# Altium schematic sheet Power.SchDoc
size A4
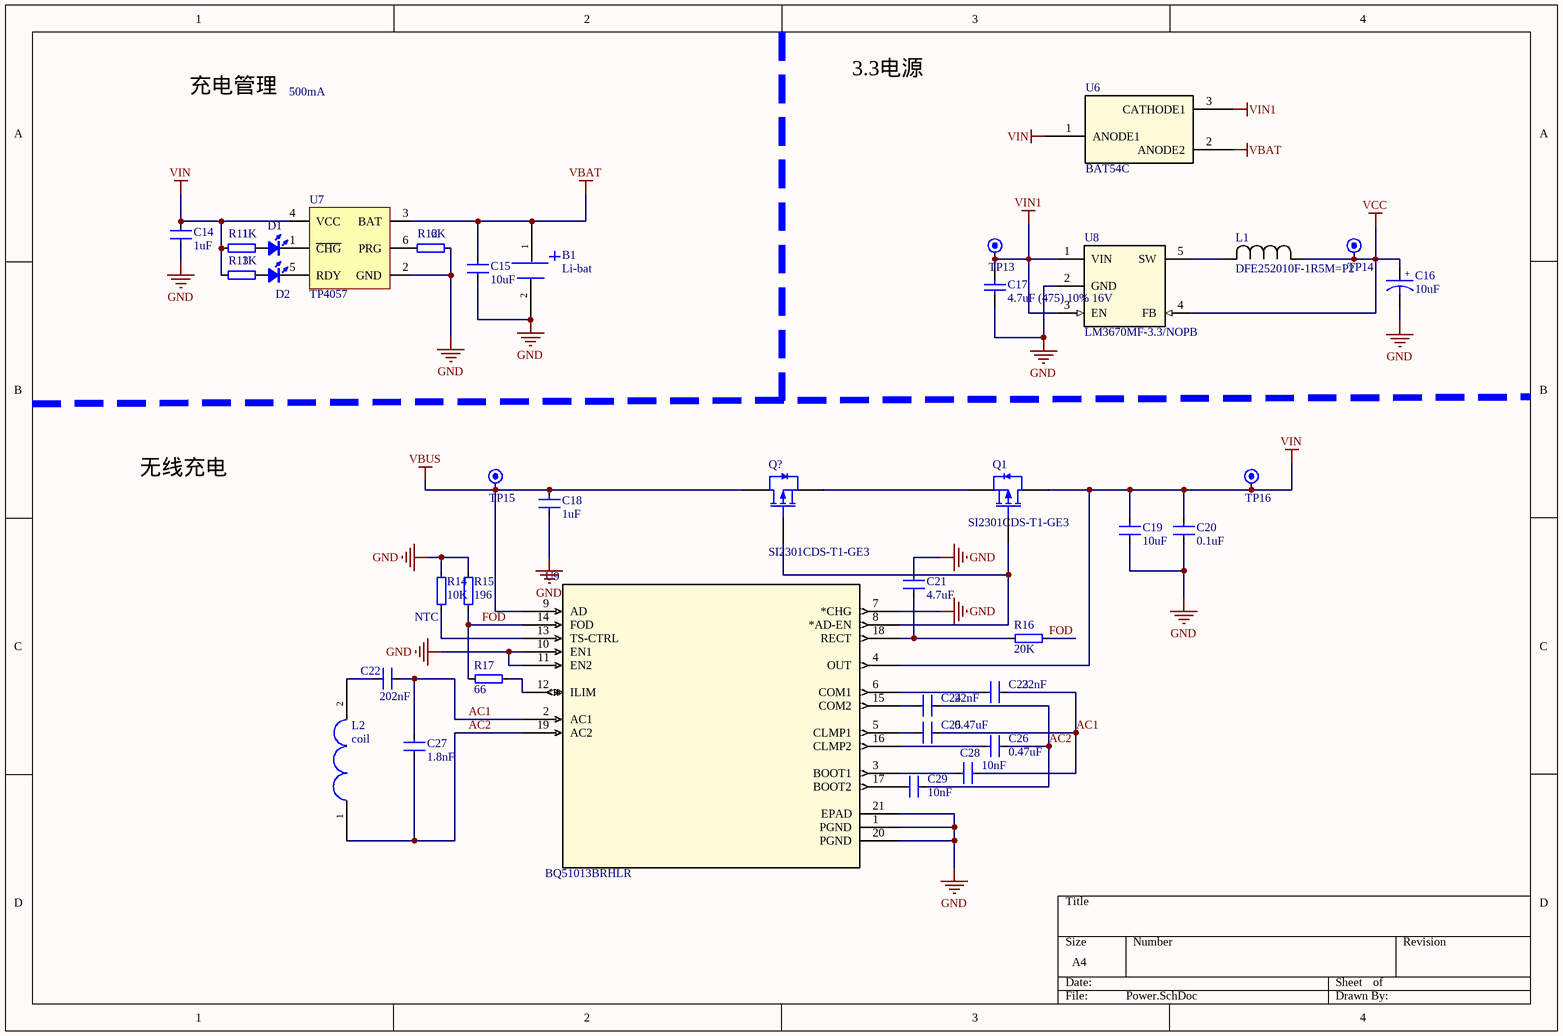
[diagram p0: Power.SchDoc]

## Parts
B1  Li-bat  [bat_li]
C14  1uF  [C0402]
C15  10uF  [C0402]
C16  10uF  [C-A]
C17  4.7uF (475) 10% 16V  [0603_C]
C18  1uF  [C0402]
C19  10uF  [C0402]
C20  0.1uF  [C0402]
C21  4.7uF  [C1206]
C22  202nF  [C0402]
C23  22nF  [C0402]
C24  22nF  [C0402]
C25  0.47uF  [C0402]
C26  0.47uF  [C0402]
C27  1.8nF  [C0402]
C28  10nF  [C0402]
C29  10nF  [C0402]
D1  color?  [LED_0402_RED]  (value not drawn)
D2  color?  [LED_0402_RED]  (value not drawn)
L1  DFE252010F-1R5M=P2  [IND_DFE252010F-1R5M=P2_MUR-M]
L2  coil  [bat_li]
Q1  SI2301CDS-T1-GE3  [SOT-23(SOT-23-3)]
Q?  SI2301CDS-T1-GE3  [SOT-23(SOT-23-3)]
R11  1K  [R0402]
R12  6K  [R0402]
R13  1K  [R0402]
R14  10K  PAKING: NTC  [R0402]
R15  196  [R0402]
R16  20K  [R0402]
R17  66  [R0402]
TP13  TP  [Test-Point]  (value not drawn)
TP14  TP  [Test-Point]  (value not drawn)
TP15  TP  [Test-Point]  (value not drawn)
TP16  TP  [Test-Point]  (value not drawn)
U6  BAT54C  [SOT23_NEX-L]
U7  TP4057  [SOT23-6]
U8  LM3670MF-3.3/NOPB  [SOT23-5]
U9  BQ51013BRHLR  [RHL20_2P05X3P05]

## Nets
GND: B1.2 C14.2 C15.2 C16.2 C17.1 C18.2 C19.2 C20.2 C21.1 R12.2 R14.2 R15.1 U7.2(GND) U8.2(GND) U9.1(PGND) U9.7(*CHG) U9.10(EN1) U9.11(EN2) U9.20(PGND) U9.21(EPAD)
VBAT: B1.1 C15.1 U6.2(ANODE2) U7.3(BAT)
VBUS: C18.1 Q?.3(D) TP15.1(Test_Point) U9.9(AD)
VCC: C16.1 L1.1 TP14.1(Test_Point) U8.4(FB)
VIN: C14.1 C19.1 C20.1 Q1.3(D) R11.1 R13.1 TP16.1(Test_Point) U6.1(ANODE1) U7.4(VCC) U9.4(OUT)
VIN1: C17.2 TP13.1(Test_Point) U6.3(CATHODE1) U8.1(VIN) U8.3(EN)
AC1: C22.2 C23.2 C25.2 C27.2 C28.2 U9.2(AC1)
AC2: C24.2 C26.2 C27.1 C29.1 L2.1 U9.19(AC2)
FOD: R15.2 R16.1 R17.2 U9.14(FOD)
NetC21_2: C21.2 R16.2 U9.18(RECT)
NetC22_1: C22.1 L2.2
NetC23_1: C23.1 U9.6(COM1)
NetC24_1: C24.1 U9.15(COM2)
NetC25_1: C25.1 U9.5(CLMP1)
NetC26_1: C26.1 U9.16(CLMP2)
NetC28_1: C28.1 U9.3(BOOT1)
NetC29_2: C29.2 U9.17(BOOT2)
NetD1_1: D1.1(A) R11.2
NetD1_2: D1.2(K) U7.1(~{CHG})
NetD2_1: D2.1(A) R13.2
NetD2_2: D2.2(K) U7.5(RDY)
NetL1_2: L1.2 U8.5(SW)
NetQ1_1: Q1.1(G) Q?.1(G) U9.8(*AD-EN)
NetQ1_2: Q1.2(S) Q?.2(S)
NetR12_1: R12.1 U7.6(PRG)
NetR14_1: R14.1 U9.13(TS-CTRL)
NetR17_1: R17.1 U9.12(ILIM)

## Notes on the sheet
- 充电管理
- 500mA
- 3.3电源
- 无线充电
- (in symbol CAP-T) +

## Library data of the parts
C14 C15 C18-C29 = CAP
C16 = CAP-T: 钽电容
C17 = 0603 4.7uF (475) 10% 16V: 贴片电容; ComponentLink1Description: 供应商链接; ComponentLink1URL: http://www.szlcsc.com/product/details_20375.html; Package: 0603; Supplier: LC; SuppliersPartNumber: C19666
D1 D2 = LED_0402: LED; Type: 0402; Value: color?
L1 = DFE252010F-1R5M=P2: No Description Available; Mfr_Name: Murata; Type: DEV; Copyright: Copyright (C) 2022 Ultra Librarian. All rights reserved.; Manufacturer_Part_Number: DFE252010F-1R5M=P2; RefDes: RefDes
L2 = L
Q1 Q? = SI2301CDS-T1-GE3: MOS(场效应管); ComponentLink1Description: 供应商链接; ComponentLink1URL: http://www.szlcsc.com/product/details_11030.html; Package: SOT-23(SOT-23-3); Supplier: LC; SuppliersPartNumber: C10487
R11-R13 R15-R17 = RES: PAKING: 0603; Precision: 5%
R14 = RES: Precision: 5%
U6 = BAT54C: No Description Available; Mfr_Name: Nexperia; Copyright: Copyright (C) 2022 Ultra Librarian. All rights reserved.; Manufacturer_Part_Number: BAT54C; RefDes: RefDes; Type: DEV
U8 = LM3670MF-3.3/NOPB: No Description Available; Mfr_Name: Texas Instruments; Type: DEV; RefDes: RefDes; Copyright: Copyright (C) 2022 Ultra Librarian. All rights reserved.; Manufacturer_Part_Number: LM3670MF-3.3/NOPB
U9 = BQ51013BRHLR: No Description Available; Mfr_Name: Texas Instruments; Copyright: Copyright (C) 2022 Ultra Librarian. All rights reserved.; Manufacturer_Part_Number: BQ51013BRHLR; RefDes: RefDes; Type: DEV